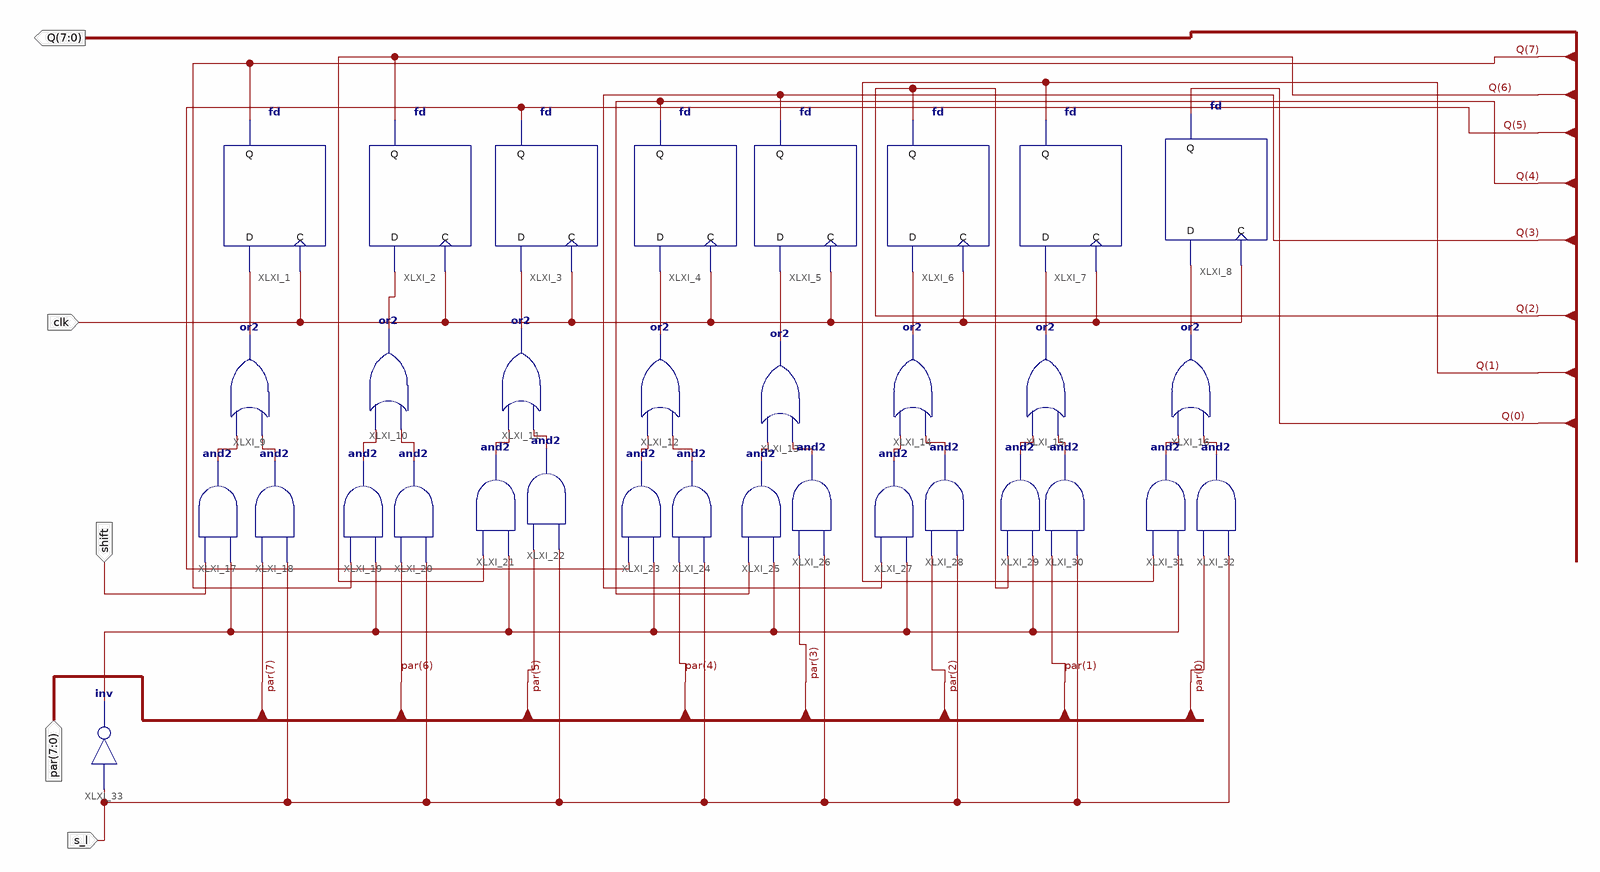
[diagram p0: schematic sheet 1]
// Xilinx ISE schematic shift8.sch (kintex7) as structural Verilog: 33 symbols, 5 ports
module shift8 (
  input  clk,
  input  s_l,
  input  [7:0] par,
  input  shift,
  output [7:0] Q
);

  wire XLXN_2, XLXN_3, XLXN_5, XLXN_6, XLXN_7, XLXN_8, XLXN_9, XLXN_10, XLXN_11, XLXN_12, XLXN_13, XLXN_14,
       XLXN_15, XLXN_16, XLXN_18, XLXN_19, XLXN_20, XLXN_21, XLXN_22, XLXN_23, XLXN_24, XLXN_25, XLXN_26,
       XLXN_27, XLXN_28;

  fd XLXI_1 (.C(clk), .D(XLXN_6), .Q(Q[7]));
  fd XLXI_2 (.C(clk), .D(XLXN_8), .Q(Q[6]));
  fd XLXI_3 (.C(clk), .D(XLXN_11), .Q(Q[5]));
  fd XLXI_4 (.C(clk), .D(XLXN_13), .Q(Q[4]));
  fd XLXI_5 (.C(clk), .D(XLXN_16), .Q(Q[3]));
  fd XLXI_6 (.C(clk), .D(XLXN_22), .Q(Q[2]));
  fd XLXI_7 (.C(clk), .D(XLXN_23), .Q(Q[1]));
  fd XLXI_8 (.C(clk), .D(XLXN_27), .Q(Q[0]));
  or XLXI_9 (XLXN_6, XLXN_5, XLXN_3);
  or XLXI_10 (XLXN_8, XLXN_9, XLXN_7);
  or XLXI_11 (XLXN_11, XLXN_12, XLXN_10);
  or XLXI_12 (XLXN_13, XLXN_15, XLXN_14);
  or XLXI_13 (XLXN_16, XLXN_19, XLXN_18);
  or XLXI_14 (XLXN_22, XLXN_21, XLXN_20);
  or XLXI_15 (XLXN_23, XLXN_25, XLXN_24);
  or XLXI_16 (XLXN_27, XLXN_28, XLXN_26);
  and XLXI_17 (XLXN_3, XLXN_2, shift);
  and XLXI_18 (XLXN_5, s_l, par[7]);
  and XLXI_19 (XLXN_7, XLXN_2, Q[7]);
  and XLXI_20 (XLXN_9, s_l, par[6]);
  and XLXI_21 (XLXN_10, XLXN_2, Q[6]);
  and XLXI_22 (XLXN_12, s_l, par[5]);
  and XLXI_23 (XLXN_14, XLXN_2, Q[5]);
  and XLXI_24 (XLXN_15, s_l, par[4]);
  and XLXI_25 (XLXN_18, XLXN_2, Q[4]);
  and XLXI_26 (XLXN_19, s_l, par[3]);
  and XLXI_27 (XLXN_20, XLXN_2, Q[3]);
  and XLXI_28 (XLXN_21, s_l, par[2]);
  and XLXI_29 (XLXN_24, XLXN_2, Q[2]);
  and XLXI_30 (XLXN_25, s_l, par[1]);
  and XLXI_31 (XLXN_26, XLXN_2, Q[1]);
  and XLXI_32 (XLXN_28, s_l, par[0]);
  not XLXI_33 (XLXN_2, s_l);
endmodule
